# Altium schematic sheet Y1BVER2.0_3.SchDoc
size A3
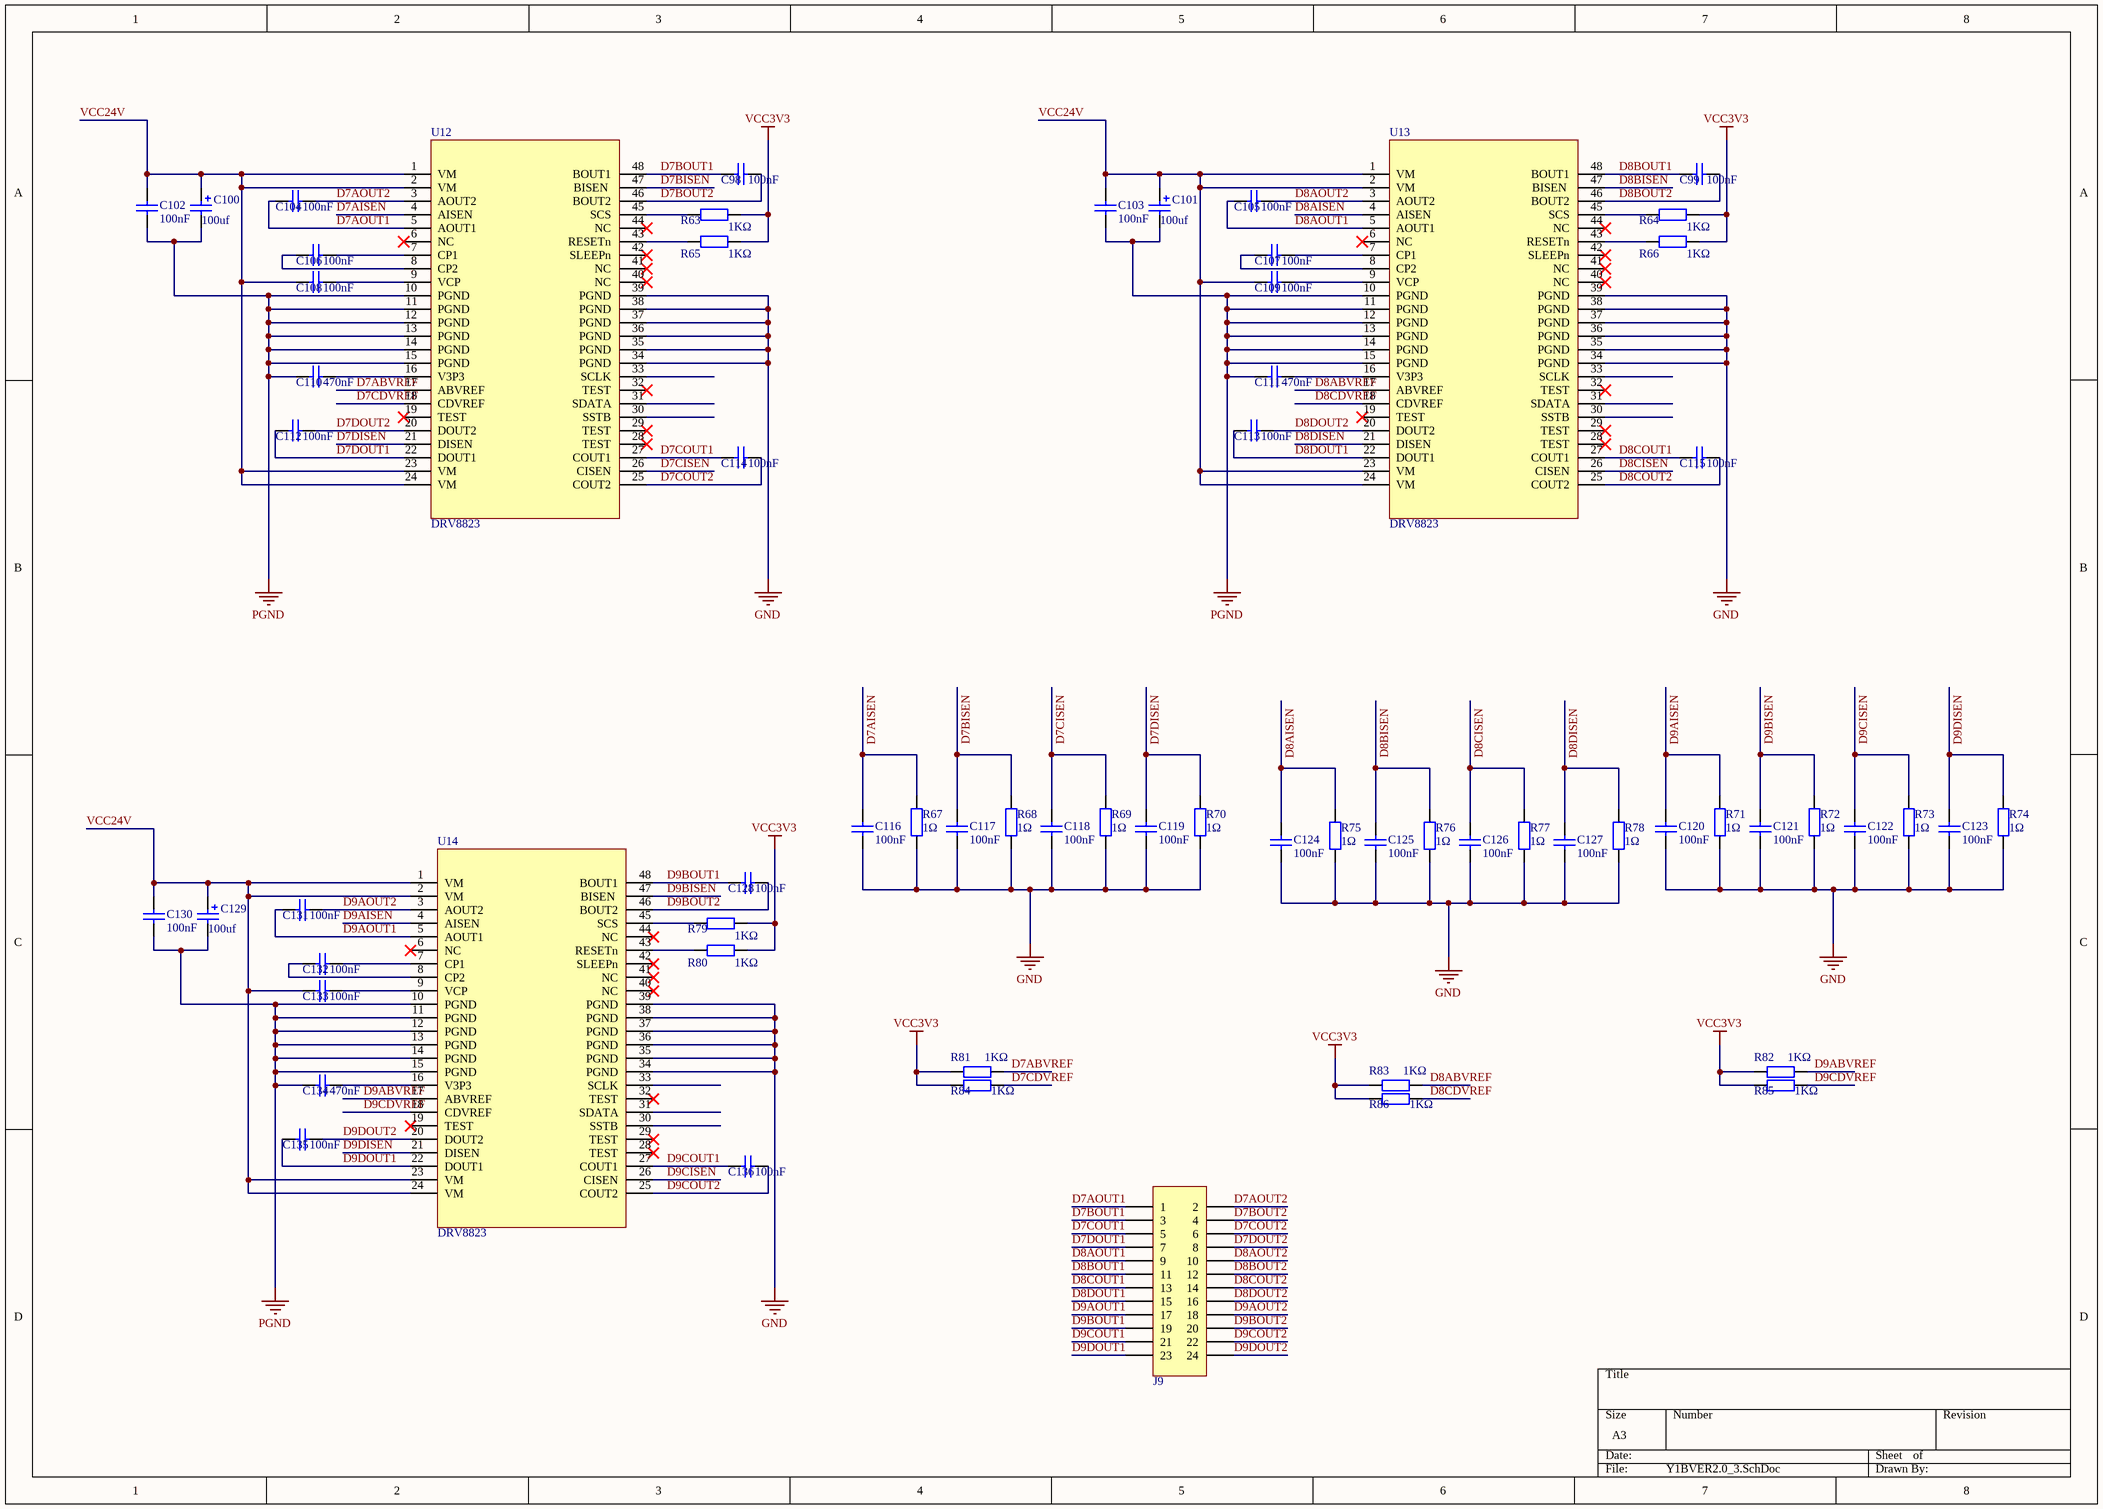
[diagram p0: Y1BVER2.0_3.SchDoc]

## Parts
C98  100nF  [0603_C]
C99  100nF  [0603_C]
C100  100uf  [E_6.3*5.4]
C101  100uf  [E_6.3*5.4]
C102  100nF  [0603_C]
C103  100nF  [0603_C]
C104  100nF  [0603_C]
C105  100nF  [0603_C]
C106  100nF  [0603_C]
C107  100nF  [0603_C]
C108  100nF  [0603_C]
C109  100nF  [0603_C]
C110  470nF  [0603_C]
C111  470nF  [0603_C]
C112  100nF  [0603_C]
C113  100nF  [0603_C]
C114  100nF  [0603_C]
C115  100nF  [0603_C]
C116  100nF  [0603_C]
C117  100nF  [0603_C]
C118  100nF  [0603_C]
C119  100nF  [0603_C]
C120  100nF  [0603_C]
C121  100nF  [0603_C]
C122  100nF  [0603_C]
C123  100nF  [0603_C]
C124  100nF  [0603_C]
C125  100nF  [0603_C]
C126  100nF  [0603_C]
C127  100nF  [0603_C]
C128  100nF  [0603_C]
C129  100uf  [E_6.3*5.4]
C130  100nF  [0603_C]
C131  100nF  [0603_C]
C132  100nF  [0603_C]
C133  100nF  [0603_C]
C134  470nF  [0603_C]
C135  100nF  [0603_C]
C136  100nF  [0603_C]
J9  header24p  [5557-2*12P]  (value not drawn)
R63  1KΩ  [0603_R]
R64  1KΩ  [0603_R]
R65  1KΩ  [0603_R]
R66  1KΩ  [0603_R]
R67  1Ω  [0603_R]
R68  1Ω  [0603_R]
R69  1Ω  [0603_R]
R70  1Ω  [0603_R]
R71  1Ω  [0603_R]
R72  1Ω  [0603_R]
R73  1Ω  [0603_R]
R74  1Ω  [0603_R]
R75  1Ω  [0603_R]
R76  1Ω  [0603_R]
R77  1Ω  [0603_R]
R78  1Ω  [0603_R]
R79  1KΩ  [0603_R]
R80  1KΩ  [0603_R]
R81  1KΩ  [0603_R]
R82  1KΩ  [0603_R]
R83  1KΩ  [0603_R]
R84  1KΩ  [0603_R]
R85  1KΩ  [0603_R]
R86  1KΩ  [0603_R]
U12  DRV8823  [HTSSOP-48]
U13  DRV8823  [HTSSOP-48]
U14  DRV8823  [HTSSOP-48]

## Nets
GND: C116.1 C117.1 C118.1 C119.1 C120.1 C121.1 C122.1 C123.1 C124.1 C125.1 C126.1 C127.1 R67.1 R68.1 R69.1 R70.1 R71.1 R72.1 R73.1 R74.1 R75.1 R76.1 R77.1 R78.1 U12.34(PGND) U12.35(PGND) U12.36(PGND) U12.37(PGND) U12.38(PGND) U12.39(PGND) U13.34(PGND) U13.35(PGND) U13.36(PGND) U13.37(PGND) U13.38(PGND) U13.39(PGND) U14.34(PGND) U14.35(PGND) U14.36(PGND) U14.37(PGND) U14.38(PGND) U14.39(PGND)
PGND: C100.2 C101.2 C102.1 C103.1 C110.1 C111.1 C129.2 C130.1 C134.1 U12.10(PGND) U12.11(PGND) U12.12(PGND) U12.13(PGND) U12.14(PGND) U12.15(PGND) U13.10(PGND) U13.11(PGND) U13.12(PGND) U13.13(PGND) U13.14(PGND) U13.15(PGND) U14.10(PGND) U14.11(PGND) U14.12(PGND) U14.13(PGND) U14.14(PGND) U14.15(PGND)
VCC3V3: R63.2 R64.2 R65.2 R66.2 R79.2 R80.2 R81.1 R82.1 R83.1 R84.1 R85.1 R86.1
D7ABVREF: R81.2 U12.17(ABVREF)
D7AISEN: C116.2 R67.2 U12.4(AISEN)
D7AOUT1: C104.1 J9.1 U12.5(AOUT1)
D7AOUT2: C104.2 J9.2 U12.3(AOUT2)
D7BISEN: C117.2 R68.2 U12.47(BISEN)
D7BOUT1: C98.1 J9.3 U12.48(BOUT1)
D7BOUT2: C98.2 J9.4 U12.46(BOUT2)
D7CDVREF: R84.2 U12.18(CDVREF)
D7CISEN: C118.2 R69.2 U12.26(CISEN)
D7COUT1: C114.1 J9.5 U12.27(COUT1)
D7COUT2: C114.2 J9.6 U12.25(COUT2)
D7DISEN: C119.2 R70.2 U12.21(DISEN)
D7DOUT1: C112.1 J9.7 U12.22(DOUT1)
D7DOUT2: C112.2 J9.8 U12.20(DOUT2)
D8ABVREF: R83.2 U13.17(ABVREF)
D8AISEN: C124.2 R75.2 U13.4(AISEN)
D8AOUT1: C105.1 J9.9 U13.5(AOUT1)
D8AOUT2: C105.2 J9.10 U13.3(AOUT2)
D8BISEN: C125.2 R76.2 U13.47(BISEN)
D8BOUT1: C99.1 J9.11 U13.48(BOUT1)
D8BOUT2: C99.2 J9.12 U13.46(BOUT2)
D8CDVREF: R86.2 U13.18(CDVREF)
D8CISEN: C126.2 R77.2 U13.26(CISEN)
D8COUT1: C115.1 J9.13 U13.27(COUT1)
D8COUT2: C115.2 J9.14 U13.25(COUT2)
D8DISEN: C127.2 R78.2 U13.21(DISEN)
D8DOUT1: C113.1 J9.15 U13.22(DOUT1)
D8DOUT2: C113.2 J9.16 U13.20(DOUT2)
D9ABVREF: R82.2 U14.17(ABVREF)
D9AISEN: C120.2 R71.2 U14.4(AISEN)
D9AOUT1: C131.1 J9.17 U14.5(AOUT1)
D9AOUT2: C131.2 J9.18 U14.3(AOUT2)
D9BISEN: C121.2 R72.2 U14.47(BISEN)
D9BOUT1: C128.1 J9.19 U14.48(BOUT1)
D9BOUT2: C128.2 J9.20 U14.46(BOUT2)
D9CDVREF: R85.2 U14.18(CDVREF)
D9CISEN: C122.2 R73.2 U14.26(CISEN)
D9COUT1: C136.1 J9.21 U14.27(COUT1)
D9COUT2: C136.2 J9.22 U14.25(COUT2)
D9DISEN: C123.2 R74.2 U14.21(DISEN)
D9DOUT1: C135.1 J9.23 U14.22(DOUT1)
D9DOUT2: C135.2 J9.24 U14.20(DOUT2)
VCC24V: C100.1 C101.1 C102.2 C103.2 C108.1 C109.1 C129.1 C130.2 C133.1 U12.1(VM) U12.2(VM) U12.23(VM) U12.24(VM) U13.1(VM) U13.2(VM) U13.23(VM) U13.24(VM) U14.1(VM) U14.2(VM) U14.23(VM) U14.24(VM)
NetC106_1: C106.1 U12.8(CP2)
NetC106_2: C106.2 U12.7(CP1)
NetC107_1: C107.1 U13.8(CP2)
NetC107_2: C107.2 U13.7(CP1)
NetC108_2: C108.2 U12.9(VCP)
NetC109_2: C109.2 U13.9(VCP)
NetC110_2: C110.2 U12.16(V3P3)
NetC111_2: C111.2 U13.16(V3P3)
NetC132_1: C132.1 U14.8(CP2)
NetC132_2: C132.2 U14.7(CP1)
NetC133_2: C133.2 U14.9(VCP)
NetC134_2: C134.2 U14.16(V3P3)
NetR63_1: R63.1 U12.45(SCS)
NetR64_1: R64.1 U13.45(SCS)
NetR65_1: R65.1 U12.43(RESETn)
NetR66_1: R66.1 U13.43(RESETn)
NetR79_1: R79.1 U14.45(SCS)
NetR80_1: R80.1 U14.43(RESETn)

Not connected (* = marked no-connect by the designer): U12 6(NC)* 19(TEST)* 28(TEST)* 29(TEST)* 30(SSTB) 31(SDATA) 32(TEST)* 33(SCLK) 40(NC)* 41(NC)* 42(SLEEPn)* 44(NC)*; U13 6(NC)* 19(TEST)* 28(TEST)* 29(TEST)* 30(SSTB) 31(SDATA) 32(TEST)* 33(SCLK) 40(NC)* 41(NC)* 42(SLEEPn)* 44(NC)*; U14 6(NC)* 19(TEST)* 28(TEST)* 29(TEST)* 30(SSTB) 31(SDATA) 32(TEST)* 33(SCLK) 40(NC)* 41(NC)* 42(SLEEPn)* 44(NC)*

## Library data of the parts
C98 C99 C102-C109 C112-C128 C130-C133 C135 C136 = 0603 100nF (104) 10% 50V: 贴片电容; ComponentLink1Description: 供应商链接; ComponentLink1URL: http://www.szlcsc.com/product/details_15331.html; Package: 0603; Supplier: LC; SuppliersPartNumber: C14663
C100 C101 C129 = C
C110 C111 C134 = 0603 470nF (474) 10% 25V: 贴片电容; ComponentLink1Description: 供应商链接; ComponentLink1URL: http://www.szlcsc.com/product/details_1975.html; Package: 0603; Supplier: LC; SuppliersPartNumber: C1623
R63-R66 R79-R86 = 0603 1KΩ (1001) 1%: 贴片电阻; ComponentLink1Description: 供应商链接; ComponentLink1URL: http://www.szlcsc.com/product/details_21904.html; Package: 0603; Supplier: LC; SuppliersPartNumber: C21190
R67-R78 = 0603 1Ω (1R00) 1%: 贴片电阻; ComponentLink1Description: 供应商链接; ComponentLink1URL: http://www.szlcsc.com/product/details_23663.html; Package: 0603; Supplier: LC; SuppliersPartNumber: C22936
U12-U14 = DRV8823: 4路BDC电机驱动